# EasyEDA Pro project ProPrj_Iris Zero_2026-02-21.epro

# Schematic Iris Zero
Board Name: IrisV1.0; Create Date: 2026-02-21; Page Name: P1; Project Name: Iris Zero; Schematic Name: Iris Zero; Update Date: 2026-02-21; Company: root://workspace; Drawn: NullByte; Page Size: A4; Version: V1.0
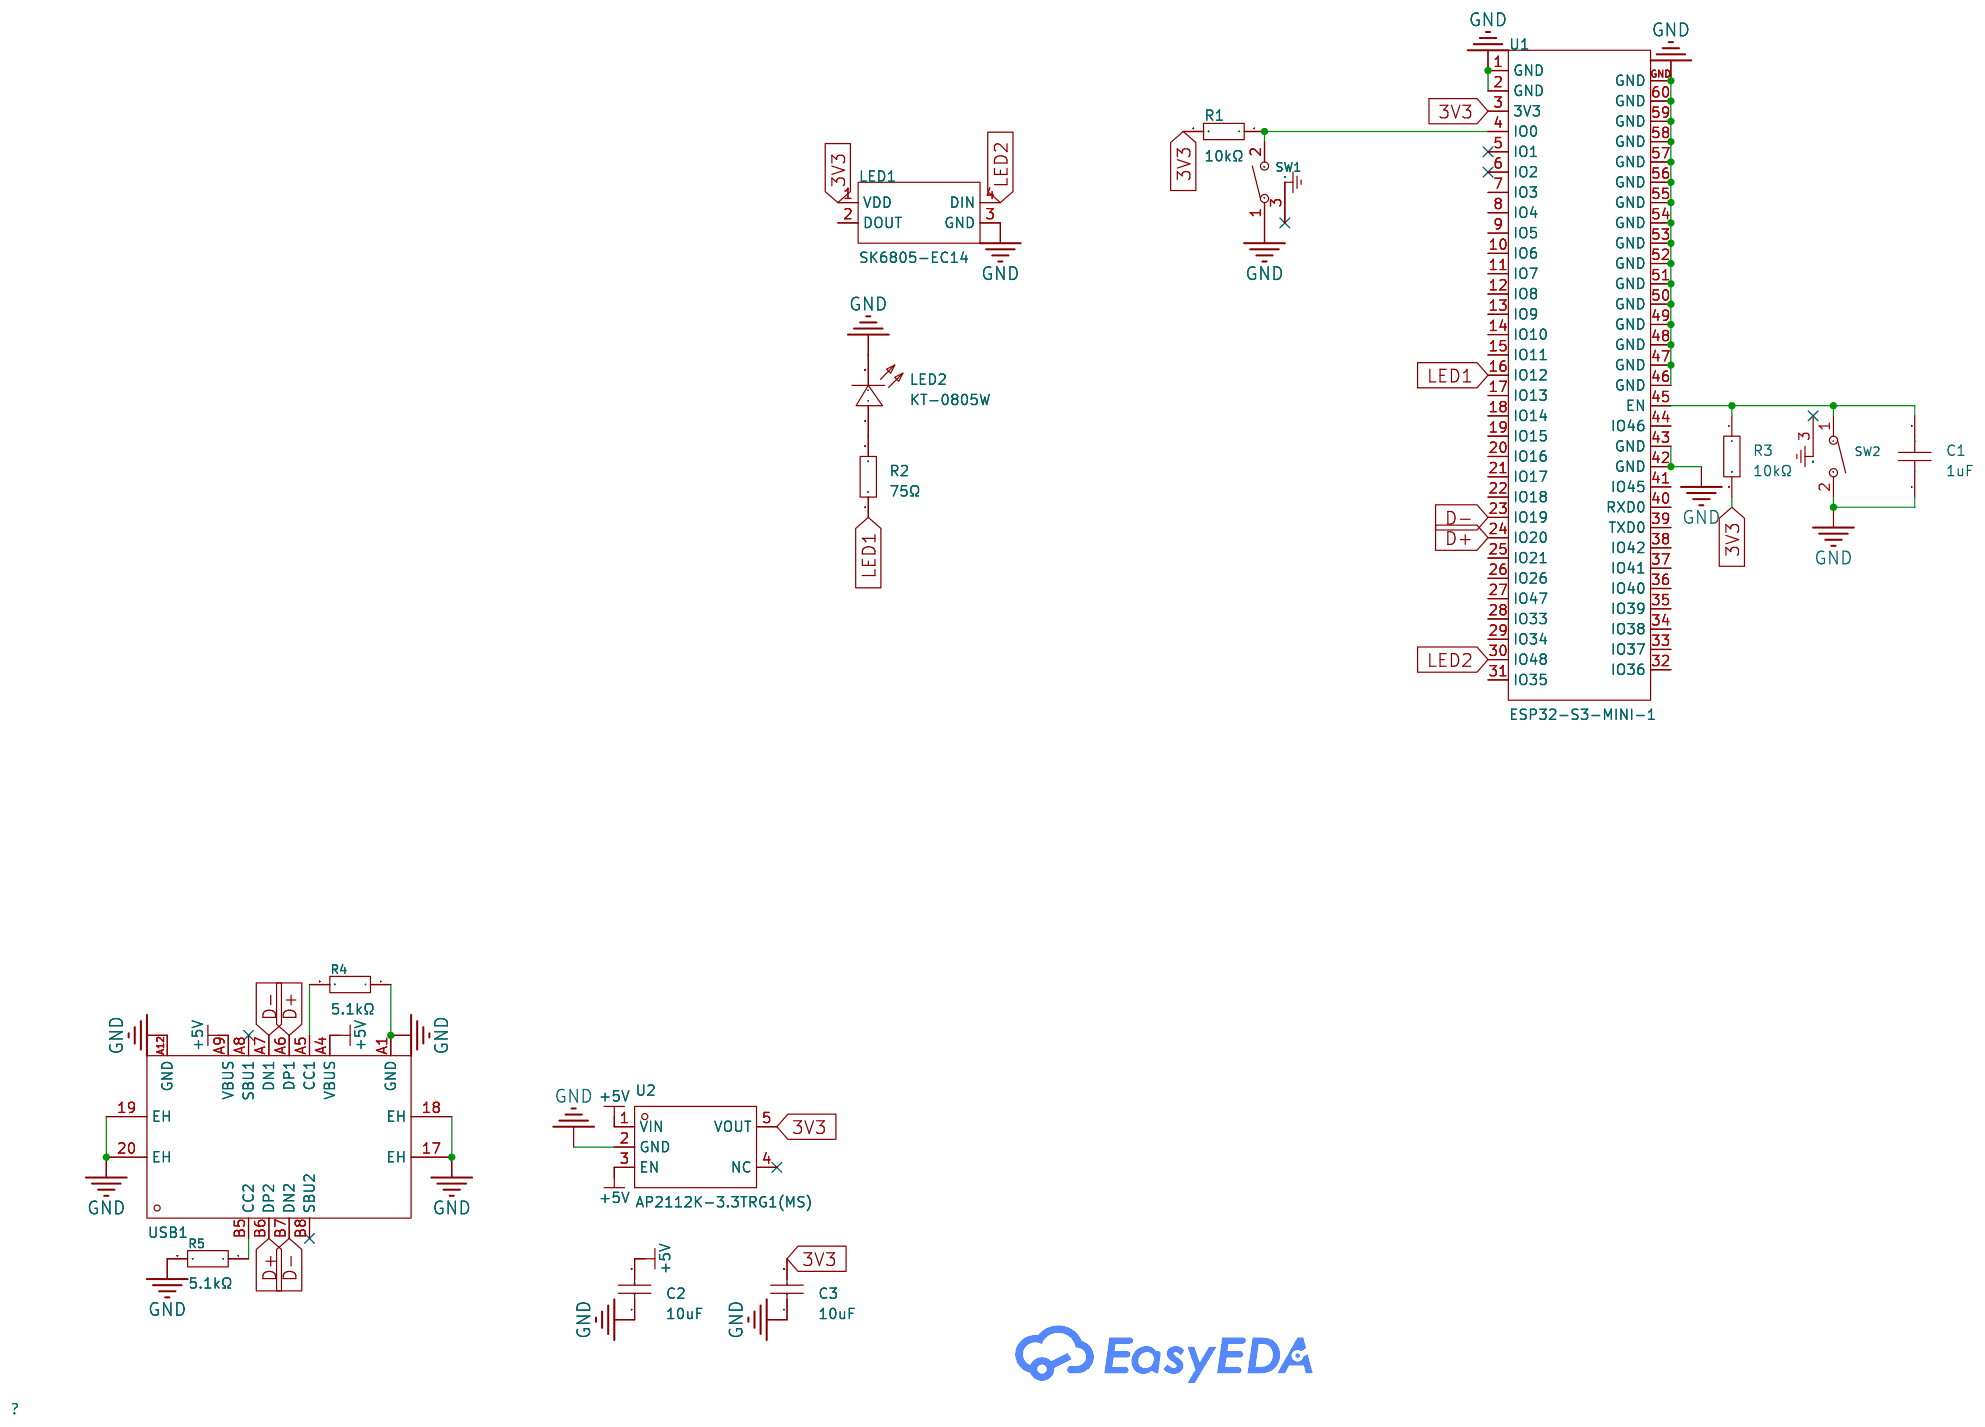
[diagram p0: schematic sheet]

## Parts
C1  1uF  [C0402]
C2  10uF  [C0402]
C3  10uF  [C0402]
LED1  SK6805-EC14  [LED-SMD_4P-L1.4-W1.4-TL]
LED2  KT-0805W  [LED0805-R-RD]
R1  10kΩ  [R0402]
R2  75Ω  [R0402]
R3  10kΩ  [R0402]
R4  5.1kΩ  [R0402]
R5  5.1kΩ  [R0402]
SW1  SKTDLHE010  [KEY-SMD_SKTDLHE010]
SW2  SKTDLHE010  [KEY-SMD_SKTDLHE010]
U1  ESP32-S3-MINI-1  [BULETM-SMD_ESP32-S3-MINI-1-N8]
U2  AP2112K-3.3TRG1(MS)  [SOT-23-5_L2.9-W1.6-P0.95-LS2.7-BR]
USB1  TYPE-C 16P QTGM027  [USB-C-SMD_TYPE-C-16P-QTGM027]

## Library data of the parts
C1 = CL05A105KA5NQNC: Capacitance:1uF Tolerance:±10% Tolerance:±10% Voltage Rating:25V Temperature Coefficient:X5R; LCSC Part Name: 1uF ±10% 25V; Supplier Part: C52923; Manufacturer: SAMSUNG(三星); Supplier Footprint: 0402; JLCPCB Part Class: Basic Part; Datasheet: https://item.szlcsc.com/datasheet/CL05A105KA5NQNC/53938.html; Supplier: LCSC; Tolerance: ±10%; Voltage Rating: 25V; Temperature Coefficient: X5R
C2 C3 = CL05A106MQ5NUNC: Capacitance:10uF Tolerance:±20% Tolerance:±20% Voltage Rating:6.3V Temperature Coefficient:X5R; LCSC Part Name: 10uF ±20% 6.3V; Supplier Part: C15525; Manufacturer: SAMSUNG(三星); Supplier Footprint: 0402; JLCPCB Part Class: Basic Part; Datasheet: https://item.szlcsc.com/datasheet/CL05A106MQ5NUNC/16204.html; Supplier: LCSC; Tolerance: ±20%; Voltage Rating: 6.3V; Temperature Coefficient: X5R
LED1 = SK6805-EC14_C2909055: LCSC Part Name: RGB三色; Supplier Part: C2909055; Manufacturer: 欧思科光电; Supplier Footprint: SMD,1.4x1.4mm; JLCPCB Part Class: Extended Part; Datasheet: https://atta.szlcsc.com/upload/public/pdf/source/20220216/66E0AA6A2A862BC6ACA495BCDA772BF7.pdf; Supplier: LCSC
LED2 = KT-0805W: LCSC Part Name: 0805 白灯 高亮; Supplier Part: C34499; Manufacturer: KENTO; Supplier Footprint: 0805; JLCPCB Part Class: Basic Part; Datasheet: https://atta.szlcsc.com/upload/public/pdf/source/20221124/DAA20402FFC1FB071B8B6797757426FE.pdf; Supplier: LCSC
R1 R3 = 0402WGF1002TCE: Type:Thick Film Resistor Resistance:10kΩ Tolerance:±1% Tolerance:±1% Power(Watts):62.5mW Voltage-Supply(Max):50V Temperature Coefficient:±100ppm/℃ Temperature Coefficient:±100ppm/℃ Operating Temperature:-55℃~+155℃ Operating Temperature:-55℃~+155℃; LCSC Part Name: 10kΩ ±1% 62.5mW 厚膜电阻; Supplier Part: C25744; Manufacturer: UNI-ROYAL(厚声); Supplier Footprint: 0402; JLCPCB Part Class: Basic Part; Datasheet: https://item.szlcsc.com/datasheet/0402WGF1002TCE/26487.html; Supplier: LCSC; Type: Thick Film Resistor; Tolerance: ±1%; Power(Watts): 62.5mW; Voltage-Supply(Max): 50V; Temperature Coefficient: ±100ppm/℃; Operating Temperature: -55℃~+155℃
R2 = 0402WGF750JTCE: Type:Thick Film Resistor Resistance:75Ω Tolerance:±1% Tolerance:±1% Power(Watts):62.5mW Voltage-Supply(Max):50V Temperature Coefficient:±100ppm/℃ Temperature Coefficient:±100ppm/℃ Operating Temperature:-55℃~+155℃ Operating Temperature:-55℃~+155℃; LCSC Part Name: 75Ω ±1% 62.5mW 厚膜电阻; Supplier Part: C25133; Manufacturer: UNI-ROYAL(厚声); Supplier Footprint: 0402; JLCPCB Part Class: Extended Part; Datasheet: https://item.szlcsc.com/datasheet/0402WGF750JTCE/25876.html; Supplier: LCSC; Type: Thick Film Resistor; Tolerance: ±1%; Power(Watts): 62.5mW; Voltage-Supply(Max): 50V; Temperature Coefficient: ±100ppm/℃; Operating Temperature: -55℃~+155℃
R4 R5 = 0402WGF5101TCE: Type:Thick Film Resistor Resistance:5.1kΩ Tolerance:±1% Tolerance:±1% Power(Watts):62.5mW Voltage-Supply(Max):50V Temperature Coefficient:±100ppm/℃ Temperature Coefficient:±100ppm/℃ Operating Temperature:-55℃~+155℃ Operating Temperature:-55℃~+155℃; LCSC Part Name: 5.1kΩ ±1% 62.5mW 厚膜电阻; Supplier Part: C25905; Manufacturer: UNI-ROYAL(厚声); Supplier Footprint: 0402; JLCPCB Part Class: Basic Part; Datasheet: https://item.szlcsc.com/datasheet/0402WGF5101TCE/26648.html; Supplier: LCSC; Type: Thick Film Resistor; Tolerance: ±1%; Power(Watts): 62.5mW; Voltage-Supply(Max): 50V; Temperature Coefficient: ±100ppm/℃; Operating Temperature: -55℃~+155℃
SW1 SW2 = SKTDLHE010: Circuit:SPST Actuator Style:Rectangle button Mounting Style:卧贴 With Lamp:- Mechanical Life:-; Supplier Part: C380198; Manufacturer: ALPSALPINE(阿尔卑斯阿尔派); Supplier Footprint: SMD; JLCPCB Part Class: Extended Part; Datasheet: https://atta.szlcsc.com/upload/public/pdf/source/20200409/C380198_178C729B1AFCBF15D3CDD9052567B65D.pdf; Supplier: LCSC; Circuit: SPST; Actuator Style: Rectangle button; Mounting Style: 卧贴
U1 = ESP32-S3-MINI-1: Supplier Part: C9900015247; JLCPCB Part Class: Extended Part; Supplier: LCSC
U2 = AP2112K-3.3TRG1(MS): Output Type:Fixed Voltage - Supply:6V Output Voltage:3.3V Output Voltage:3.3V Output Current:600mA Power Supply Rejection Ratio (PSRR):75dB@(1kHz) Voltage Dropout:- standby current:2uA Noise:- Features:Automatic Discharge Function；Low ESR；Overheat protect; Supplier Part: C22365427; Manufacturer: MSKSEMI(美森科); Supplier Footprint: SOT-23-5; JLCPCB Part Class: Extended Part; Datasheet: https://item.szlcsc.com/datasheet/AP2112K-3.3TRG1(MS)/23832169.html; Supplier: LCSC; Output Type: Fixed; Voltage - Supply: 6V; Output Voltage: 3.3V; Output Current: 600mA; Power Supply Rejection Ratio (PSRR): 75dB@(1kHz); standby current: 2uA; Features: Automatic Discharge Function；Low ESR；Overheat protection；Overcurrent Protection；With ability; Operating Temperature: -40℃~+125℃@(Tj); Output Configuration: Positive electrode; Number of Outputs: 1
USB1 = TYPE-C 16P QTGM027: Connector Type:Type-C Protocol Standard:USB 3.1 Gender:Female Mounting Type:Surface Mount, Right Angle Number of Contacts:16P Number of Ports:1 Current Rating-Power:3A Voltage Rating:20V Connect-Disconnect Life:5,000 times Detection color:Black Operating; LCSC Part Name: 16P卧贴母座; Supplier Part: C2681552; Manufacturer: SHOU HAN(首韩); Supplier Footprint: SMD; JLCPCB Part Class: Extended Part; Datasheet: https://item.szlcsc.com/datasheet/TYPE-C%252016P%2520QTGM027/2774895.html; Supplier: LCSC; Connector Type: Type-C; Protocol Standard: USB 3.1; Gender: Female; Mounting Type: Surface Mount, Right Angle; Number of Contacts: 16P; Number of Ports: 1; Current Rating-Power: 3A; Voltage Rating: 20V; Connect-Disconnect Life: 5,000 times; Detection color: Black; Operating Temperature: -30℃~+80℃

## Nets
3V3: C3.2 LED1.1(VDD) R1.2 R3.2 U1.3(3V3) U2.5(VOUT)
+5V: C2.2 U2.1(VIN) U2.3(EN) USB1.A4(VBUS) USB1.A9(VBUS)
GND: C1.1 C2.1 C3.1 LED1.3(GND) LED2.2(K) R4.1 R5.2 SW1.1 SW2.2 U1.1(GND) U1.2(GND) U1.42(GND) U1.43(GND) U1.46(GND) U1.47(GND) U1.48(GND) U1.49(GND) U1.50(GND) U1.51(GND) U1.52(GND) U1.53(GND) U1.54(GND) U1.55(GND) U1.56(GND) U1.57(GND) U1.58(GND) U1.59(GND) U1.60(GND) U1.GND U2.2(GND) USB1.17(EH) USB1.18(EH) USB1.19(EH) USB1.20(EH) USB1.A1(GND) USB1.A12(GND)
D+: U1.24(IO20) USB1.A6(DP1) USB1.B6(DP2)
D-: U1.23(IO19) USB1.A7(DN1) USB1.B7(DN2)
LED1: R2.1 U1.16(IO12)
LED2: LED1.4(DIN) U1.30(IO48)
$1N11906: R5.1 USB1.B5(CC2)
$1N11910: R4.2 USB1.A5(CC1)
$1N16423: R1.1 SW1.2 U1.4(IO0)
$1N16427: LED2.1(A) R2.2
$1N16438: C1.2 R3.1 SW2.1 U1.45(EN)

Not connected (* = marked no-connect by the designer): LED1 2(DOUT); SW1 3(GND)*; SW2 3(GND)*; U1 5(IO1)* 6(IO2)* 7(IO3) 8(IO4) 9(IO5) 10(IO6) 11(IO7) 12(IO8) 13(IO9) 14(IO10) 15(IO11) 17(IO13) 18(IO14) 19(IO15) 20(IO16) 21(IO17) 22(IO18) 25(IO21) 26(IO26) 27(IO47) 28(IO33) 29(IO34) 31(IO35) 32(IO36) 33(IO37) 34(IO38) 35(IO39) 36(IO40) 37(IO41) 38(IO42) 39(TXD0) 40(RXD0) 41(IO45) 44(IO46); U2 4(NC)*; USB1 A8(SBU1)* B8(SBU2)*

# Board PCB1
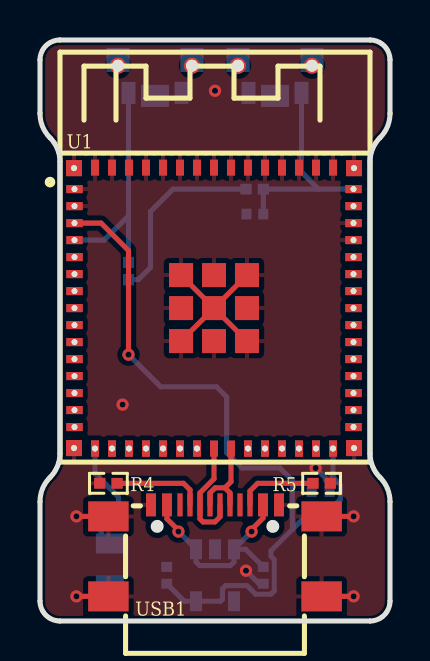
[diagram p1: board, top side]
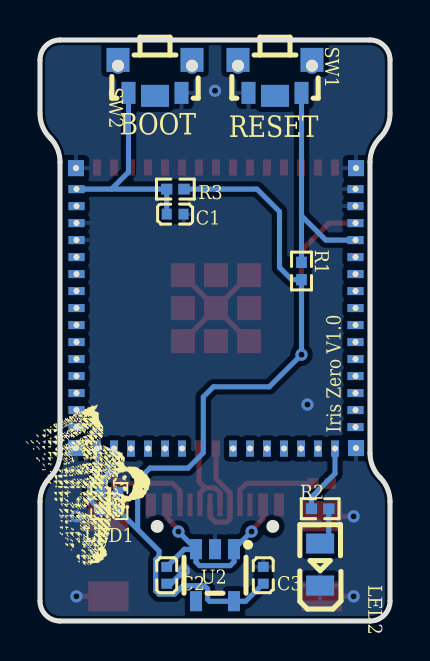
[diagram p2: board, bottom side, seen from below]

Outline 17.5 x 29.06 mm; copper layers: Top Layer, Bottom Layer. Coordinates in mm from the lower left corner of the outline.
Outline path: 0,28.06 arc(0.29,28.76) 1,29.06 16.5,29.06 arc(17.21,28.76) 17.5,28.06 17.5,25.38 arc(17.37,24.72) 17,24.17 arc(16.63,23.61) 16.5,22.96 16.5,8.39 arc(16.63,7.73) 17,7.18 arc(17.37,6.63) 17.5,5.97 17.5,1 arc(17.21,0.29) 16.5,0 1,0 arc(0.29,0.29) 0,1 0,5.97 arc(0.13,6.63) 0.5,7.18 arc(0.87,7.73) 1,8.39 1,22.96 arc(0.87,23.62) 0.5,24.17 arc(0.13,24.72) 0,25.38 0,28.06
Stack: Top Layer 0.035mm / Dielectric1 1.51mm FR4 er 4.5 / Bottom Layer 0.035mm

## Design rules (mm)
template: JLCPCB Capability(Two Layers Board)
spacing copperThickness1oz (default): track to track 0.102, other pairs 0.152 to 0.3
spacing copperThickness2oz: track to track 0.203, other pairs 0.152 to 0.3
track width copperThickness1oz (default): min 0.127, default 0.254, max 2.54
track width copperThickness2oz: min 0.203, default 0.254, max 2.54
differential pair differentialPair (default): width min 0.127, default 0.254, max 2.54; gap min 0.152, default 0.152
via viaSize (default): diameter min 0.5, default 0.61, max 10; hole min 0.3, default 0.305, max 6.3

## Placement (name value [footprint] x y rotation side)
C1  1uF  [C0402]  10.74 20.35 0 bottom
C2  10uF  [C0402]  11.16 2.29 90 bottom
C3  10uF  [C0402]  6.34 2.29 270 bottom
LED1  SK6805-EC14  [LED-SMD_4P-L1.4-W1.4-TL]  14.03 6 0 bottom
LED2  KT-0805W  [LED0805-R-RD]  3.49 2.82 90 bottom
NOREF  -  [Pad_e283]  15.7 8.65 0 top
NOREF#2  -  [Pad_e249]  1.72 9.7 0 top
NOREF#3  -  [Pad_e268]  5.3 8.62 90 top
NOREF#4  -  [Pad_e256]  15.67 13.1 0 top
NOREF#5  -  [Pad_e254]  15.67 11.4 0 top
NOREF#6  -  [Pad_e248]  1.72 10.55 0 top
NOREF#7  -  [Pad_e269]  6.15 8.62 90 top
NOREF#8  -  [Pad_e251]  3.6 8.62 90 top
NOREF#9  -  [Pad_e284]  1.7 8.65 0 top
NOREF#10  -  [Pad_e264]  15.67 19.9 0 top
NOREF#11  -  [Pad_e261]  15.67 17.35 0 top
NOREF#12  -  [Pad_e265]  15.67 20.75 0 top
NOREF#13  -  [Pad_e246]  1.72 12.25 0 top
NOREF#14  -  [Pad_e278]  12.95 8.62 90 top
NOREF#15  -  [Pad_e266]  15.67 21.6 0 top
NOREF#16  -  [Pad_e270]  7 8.62 90 top
NOREF#17  -  [Pad_e262]  15.67 18.2 0 top
NOREF#18  -  [Pad_e277]  12.1 8.62 90 top
NOREF#19  -  [Pad_e252]  15.67 9.7 0 top
NOREF#20  -  [Pad_e257]  15.67 13.95 0 top
NOREF#21  -  [Pad_e286]  15.7 22.65 0 top
NOREF#22  -  [Pad_e279]  13.8 8.62 90 top
NOREF#23  -  [Pad_e259]  15.67 15.65 0 top
NOREF#24  -  [Pad_e237]  1.72 19.9 0 top
NOREF#25  -  [Pad_e239]  1.72 18.2 0 top
NOREF#26  -  [Pad_e253]  15.67 10.55 0 top
NOREF#27  -  [Pad_e263]  15.67 19.05 0 top
NOREF#28  -  [Pad_e276]  11.25 8.62 90 top
NOREF#29  -  [Pad_e250]  2.75 8.62 90 top
NOREF#30  -  [Pad_e267]  4.45 8.62 90 top
NOREF#31  -  [Pad_e247]  1.72 11.4 0 top
NOREF#32  -  [Pad_e255]  15.67 12.25 0 top
NOREF#33  -  [Pad_e285]  1.7 22.65 0 top
NOREF#34  -  [Pad_e244]  1.72 13.95 0 top
NOREF#35  -  [Pad_e242]  1.72 15.65 0 top
NOREF#36  -  [Pad_e271]  7.85 8.62 90 top
NOREF#37  -  [Pad_e238]  1.72 19.05 0 top
NOREF#38  -  [Pad_e260]  15.67 16.5 0 top
NOREF#39  -  [Pad_e275]  10.4 8.62 90 top
NOREF#40  -  [Pad_e280]  14.65 8.62 90 top
NOREF#41  -  [Pad_e243]  1.72 14.8 0 top
NOREF#42  -  [Pad_e258]  15.67 14.8 0 top
NOREF#43  -  [Pad_e236]  1.72 20.75 0 top
NOREF#44  -  [Pad_e245]  1.72 13.1 0 top
NOREF#45  -  [Pad_e235]  1.72 21.6 0 top
NOREF#46  -  [Pad_e240]  1.72 17.35 0 top
NOREF#47  -  [Pad_e241]  1.72 16.5 0 top
R1  10kΩ  [R0402]  4.42 17.5 270 bottom
R2  75Ω  [R0402]  3.49 5.62 180 bottom
R3  10kΩ  [R0402]  10.73 21.6 180 bottom
R4  5.1kΩ  [R0402]  3.42 6.89 0 top
R5  5.1kΩ  [R0402]  14.08 6.89 0 top
SW1  SKTDLHE010  [KEY-SMD_SKTDLHE010]  5.75 27.16 180 bottom
SW2  SKTDLHE010  [KEY-SMD_SKTDLHE010]  11.75 27.16 180 bottom
U1  ESP32-S3-MINI-1  [BULETM-SMD_ESP32-S3-MINI-1-N8]  8.7 15.65 0 top
U2  AP2112K-3.3TRG1(MS)  [SOT-23-5_L2.9-W1.6-P0.95-LS2.7-BR]  8.75 2.29 90 bottom
USB1  TYPE-C 16P QTGM027  [USB-C-SMD_TYPE-C-16P-QTGM027]  8.75 3.52 0 top

## Footprints (pads in the part's own frame, mm; a bottom-side part is the same pattern mirrored in y, then rotated)
BULETM-SMD_ESP32-S3-MINI-1-N8
  rect 0.8x0.4 smd: 1(-6.975,5.95) 2(-6.975,5.1) 3(-6.975,4.25) 4(-6.975,3.4) 5(-6.975,2.55) 6(-6.975,1.7) 7(-6.975,0.85) 8(-6.975,0) 9(-6.975,-0.85) 10(-6.975,-1.7) 11(-6.975,-2.55) 12(-6.975,-3.4) 13(-6.975,-4.25) 14(-6.975,-5.1) 15(-6.975,-5.95) 31(6.975,-5.95) 32(6.975,-5.1) 33(6.975,-4.25) 34(6.975,-3.4) 35(6.975,-2.55) 36(6.975,-1.7) 37(6.975,-0.85) 38(6.975,0) 39(6.975,0.85) 40(6.975,1.7) 41(6.975,2.55) 42(6.975,3.4) 43(6.975,4.25) 44(6.975,5.1) 45(6.975,5.95)
  rect 0.4x0.8 smd: 16(-5.95,-7.025) 17(-5.1,-7.025) 18(-4.25,-7.025) 19(-3.4,-7.025) 20(-2.55,-7.025) 21(-1.7,-7.025) 22(-0.85,-7.025) 23(0,-7.025) 24(0.85,-7.025) 25(1.7,-7.025) 26(2.55,-7.025) 27(3.4,-7.025) 28(4.25,-7.025) 29(5.1,-7.025) 30(5.95,-7.025) 46(5.95,7.025) 47(5.1,7.025) 48(4.25,7.025) 49(3.4,7.025) 50(2.55,7.025) 51(1.7,7.025) 52(0.85,7.025) 53(0,7.025) 54(-0.85,7.025) 55(-1.7,7.025) 56(-2.55,7.025) 57(-3.4,7.025) 58(-4.25,7.025) 59(-5.1,7.025) 60(-5.95,7.025)
  rect 0.8x0.8 smd: GND(-7,7) GND(-7,-7) GND(7,7) GND(7,-7)
  rect 1.2x1.2 smd: GND(-1.65,1.65) GND(-1.65,0) GND(-1.65,-1.65) GND(0,1.65) GND(0,0) GND(0,-1.65) GND(1.65,1.65) GND(1.65,0) GND(1.65,-1.65)
C0402
  rect 0.5x0.54 smd: 1(-0.42,0) 2(0.42,0)
KEY-SMD_SKTDLHE010
  rect 0.7x1.1 smd: 1(-1.325,-0.75) 2(1.325,-0.75)
  round 0.8 hole 0.6: 3(-1.85,0.608) 3(1.85,0.608)
  rect 1.15x1.2 smd: 3(-1.85,0.9) 3(1.85,0.9)
  rect 1.4x1.1 smd: 3(0,-0.9)
LED0805-R-RD
  rect 1x1.399 smd: 1(1.05,0) 2(-1.05,0)
LED-SMD_4P-L1.4-W1.4-TL
  rect 0.5x0.5 smd: 1(-0.45,0.45) 2(-0.45,-0.45) 3(0.45,-0.45) 4(0.45,0.45)
Pad_e235
  rect 0.8x0.4 hole 0.3: 1(0,0)
Pad_e236
  rect 0.8x0.4 hole 0.3: 1(0,0)
Pad_e237
  rect 0.8x0.4 hole 0.3: 1(0,0)
Pad_e238
  rect 0.8x0.4 hole 0.3: 1(0,0)
Pad_e239
  rect 0.8x0.4 hole 0.3: 1(0,0)
Pad_e240
  rect 0.8x0.4 hole 0.3: 1(0,0)
Pad_e241
  rect 0.8x0.4 hole 0.3: 1(0,0)
Pad_e242
  rect 0.8x0.4 hole 0.3: 1(0,0)
Pad_e243
  rect 0.8x0.4 hole 0.3: 1(0,0)
Pad_e244
  rect 0.8x0.4 hole 0.3: 1(0,0)
Pad_e245
  rect 0.8x0.4 hole 0.3: 1(0,0)
Pad_e246
  rect 0.8x0.4 hole 0.3: 1(0,0)
Pad_e247
  rect 0.8x0.4 hole 0.3: 1(0,0)
Pad_e248
  rect 0.8x0.4 hole 0.3: 1(0,0)
Pad_e249
  rect 0.8x0.4 hole 0.3: 1(0,0)
Pad_e250
  rect 0.8x0.4 hole 0.3: 1(0,0)
Pad_e251
  rect 0.8x0.4 hole 0.3: 1(0,0)
Pad_e252
  rect 0.8x0.4 hole 0.3: 1(0,0)
Pad_e253
  rect 0.8x0.4 hole 0.3: 1(0,0)
Pad_e254
  rect 0.8x0.4 hole 0.3: 1(0,0)
Pad_e255
  rect 0.8x0.4 hole 0.3: 1(0,0)
Pad_e256
  rect 0.8x0.4 hole 0.3: 1(0,0)
Pad_e257
  rect 0.8x0.4 hole 0.3: 1(0,0)
Pad_e258
  rect 0.8x0.4 hole 0.3: 1(0,0)
Pad_e259
  rect 0.8x0.4 hole 0.3: 1(0,0)
Pad_e260
  rect 0.8x0.4 hole 0.3: 1(0,0)
Pad_e261
  rect 0.8x0.4 hole 0.3: 1(0,0)
Pad_e262
  rect 0.8x0.4 hole 0.3: 1(0,0)
Pad_e263
  rect 0.8x0.4 hole 0.3: 1(0,0)
Pad_e264
  rect 0.8x0.4 hole 0.3: 1(0,0)
Pad_e265
  rect 0.8x0.4 hole 0.3: 1(0,0)
Pad_e266
  rect 0.8x0.4 hole 0.3: 1(0,0)
Pad_e267
  rect 0.8x0.4 hole 0.3: 1(0,0)
Pad_e268
  rect 0.8x0.4 hole 0.3: 1(0,0)
Pad_e269
  rect 0.8x0.4 hole 0.3: 1(0,0)
Pad_e270
  rect 0.8x0.4 hole 0.3: 1(0,0)
Pad_e271
  rect 0.8x0.4 hole 0.3: 1(0,0)
Pad_e275
  rect 0.8x0.4 hole 0.3: 1(0,0)
Pad_e276
  rect 0.8x0.4 hole 0.3: 1(0,0)
Pad_e277
  rect 0.8x0.4 hole 0.3: 1(0,0)
Pad_e278
  rect 0.8x0.4 hole 0.3: 1(0,0)
Pad_e279
  rect 0.8x0.4 hole 0.3: 1(0,0)
Pad_e280
  rect 0.8x0.4 hole 0.3: 1(0,0)
Pad_e283
  rect 0.8x0.8 hole 0.3: 1(0,0)
Pad_e284
  rect 0.8x0.8 hole 0.3: 1(0,0)
Pad_e285
  rect 0.8x0.8 hole 0.3: 1(0,0)
Pad_e286
  rect 0.8x0.8 hole 0.3: 1(0,0)
R0402
  rect 0.566x0.54 smd: 1(-0.433,0) 2(0.433,0)
SOT-23-5_L2.9-W1.6-P0.95-LS2.7-BR
  rect 1x0.6 smd: 1(1.3,-0.95) 2(1.3,0) 3(1.3,0.95) 4(-1.3,0.95) 5(-1.3,-0.95)
USB-C-SMD_TYPE-C-16P-QTGM027
  rect 2.02x1.5 smd: 17(5.33,1.712) 18(5.33,-2.288) 19(-5.33,-2.288) 20(-5.33,1.712)
  rect 0.5x1.15 smd: A1(-3.2,2.288) A4(-2.4,2.288) A9(2.4,2.288) A12(3.2,2.288)
  rect 0.26x1.15 smd: A5(-1.25,2.288) A6(-0.25,2.288) A7(0.25,2.288) A8(1.25,2.288) B5(1.75,2.288) B6(0.75,2.288) B7(-0.75,2.288) B8(-1.75,2.288)

## Nets
3V3: C3.2 LED1.1 NOREF#24.1 R1.2 R3.2 U1.3 U2.5
+5V: C2.2 U2.1 U2.3 USB1.A4 USB1.A9
GND: C1.1 C2.1 C3.1 LED1.3 LED2.2 NOREF.1 NOREF#9.1 NOREF#10.1 NOREF#21.1 NOREF#27.1 NOREF#33.1 NOREF#43.1 NOREF#45.1 R4.1 R5.2 SW1.1 SW2.2 U1.1 U1.2 U1.42 U1.43 U1.46 U1.47 U1.48 U1.49 U1.50 U1.51 U1.52 U1.53 U1.54 U1.55 U1.56 U1.57 U1.58 U1.59 U1.60 U1.GND U2.2 USB1.17 USB1.18 USB1.19 USB1.20 USB1.A1 USB1.A12
D+: U1.24 USB1.A6 USB1.B6
D-: U1.23 USB1.A7 USB1.B7
LED1: NOREF#29.1 R2.1 U1.16
LED2: LED1.4 NOREF#40.1 U1.30
$1N11906: R5.1 USB1.B5
$1N11910: R4.2 USB1.A5
$1N16423: NOREF#37.1 R1.1 SW1.2 U1.4
$1N16427: LED2.1 R2.2
$1N16438: C1.2 NOREF#15.1 R3.1 SW2.1 U1.45

Pads without a net: LED1 2; NOREF#2 1; NOREF#3 1; NOREF#4 1; NOREF#5 1; NOREF#6 1; NOREF#7 1; NOREF#8 1; NOREF#11 1; NOREF#12 1; NOREF#13 1; NOREF#14 1; NOREF#16 1; NOREF#17 1; NOREF#18 1; NOREF#19 1; NOREF#20 1; NOREF#22 1; NOREF#23 1; NOREF#25 1; NOREF#26 1; NOREF#28 1; NOREF#30 1; NOREF#31 1; NOREF#32 1; NOREF#34 1; NOREF#35 1; NOREF#36 1; NOREF#38 1; NOREF#39 1; NOREF#41 1; NOREF#42 1; NOREF#44 1; NOREF#46 1; NOREF#47 1; SW1 3; SW2 3; U1 5 6 7 8 9 10 11 12 13 14 15 17 18 19 20 21 22 25 26 27 28 29 31 32 33 34 35 36 37 38 39 40 41 44; U2 4; USB1 A8 B8

## Via types
v1: diameter 0.61, hole 0.305, Top Layer to Bottom Layer, 11 vias

## Routing (per net, layer and track width the routed paths; a pad name or vN(x,y) marks a point on that pad's centre or on a via; arc(x,y) is an arc through that point)
3V3: length 48.1
  Top Layer w0.254: NOREF#24.1 3.05,19.9 4.42,18.53 v1(4.42,13.32)
  Bottom Layer w0.254: C3.2 7.22,0.99 U2.5 9.03,0.99 9.12,1.08 9.12,1.6 9.28,1.77 10.35,1.77 10.78,1.34 11.55,1.34 11.71,1.5 11.71,3.07 11.55,3.24 11.55,3.51 12.62,4.58 ; 12.62,4.58 LED1.1 ; 12.62,4.58 12.62,7.03 12,7.65 10.1,7.65 9.33,8.41 9.33,11.2 8.83,11.71 6.03,11.71 v1(4.42,13.32) R1.2 4.91,17.07 5.52,17.68 5.52,20.47 6.65,21.6 10.3,21.6
+5V: length 10.8
  Top Layer w0.254: USB1.A9 11.15,5.14 10.58,4.57 v1(10.58,4.47) ; USB1.A4 6.35,5.11 6.92,4.54 v1(6.92,4.47)
  Bottom Layer w0.254: U2.3 9.7,2.95 9.52,2.77 7.99,2.77 7.8,2.96 U2.1 7.8,3.59 v1(6.92,4.47) ; U2.3 10.28,3.59 C2.2 ; U2.3 10.58,4.47 v1(10.58,4.47)
GND: length 18.4
  Top Layer w0.254: U1.GND U1.GND ; U1.GND U1.GND ; U1.GND U1.GND ; U1.GND U1.GND ; USB1.20 v1(1.82,5.23) ; USB1.19 v1(1.82,1.23) ; USB1.17 v1(15.68,5.23) ; USB1.18 v1(15.68,1.23)
  Bottom Layer w0.254: C2.1 10.95,1.87 v1(10.3,2.52) ; LED1.3 14.48,6.84 14.29,7.03 14.29,7.13 v1(13.78,7.65)
  vias: v1(4.13,10.82) v1(8.75,26.52)
D+: length 4.5
  Top Layer w0.254: 9.25,6.66 8.75,6.66 8.5,6.41 USB1.A6 ; 9.25,6.66 9.55,6.97 U1.24 ; 9.25,6.66 9.5,6.41 USB1.B6
D-: length 5.6
  Top Layer w0.254: U1.23 8.7,7.11 8,6.41 USB1.B7 8,5.11 8.15,4.95 8.75,4.95 9,5.21 USB1.A7
LED1: length 3.5
  Bottom Layer w0.254: NOREF#29.1 2.75,7.38 3.93,6.2 R2.1
LED2: length 3.4
  Bottom Layer w0.254: U1.30 14.65,7.18 15.01,6.81 15.01,6.08 LED1.4
$1N11906: length 4
  Top Layer w0.254: R5.1 10.88,6.89 10.5,6.5 USB1.B5
$1N11910: length 4.5
  Top Layer w0.254: R4.2 7.18,6.89 7.5,6.56 USB1.A5
$1N16423: length 11.7
  Bottom Layer w0.254: R1.1 4.42,20.26 ; SW1.2 4.42,20.26 3.21,19.05 NOREF#37.1
$1N16427: length 1.9
  Bottom Layer w0.254: R2.2 3.06,4.3 LED2.1
$1N16438: length 10.9
  Bottom Layer w0.254: SW2.1 13.07,22.45 13.93,21.6 ; 13.93,21.6 R3.1 11.16,20.35 ; 13.93,21.6 NOREF#15.1

## Copper pours and planes (outline as drawn; the poured copper is in the pictures)
GND on Top Layer: -2.09,30.13 20.64,30.13 20.64,-2.89 -2.09,-2.89
GND on Bottom Layer: -2.48,30.63 20.38,30.63 20.38,-1.75 -2.48,-1.75

## Text on the board
Bottom Silkscreen Layer: Iris Zero V1.0 | RESET | BOOT
